# Altium schematic sheet LED.SchDoc
size A4; DocumentNumber: 1
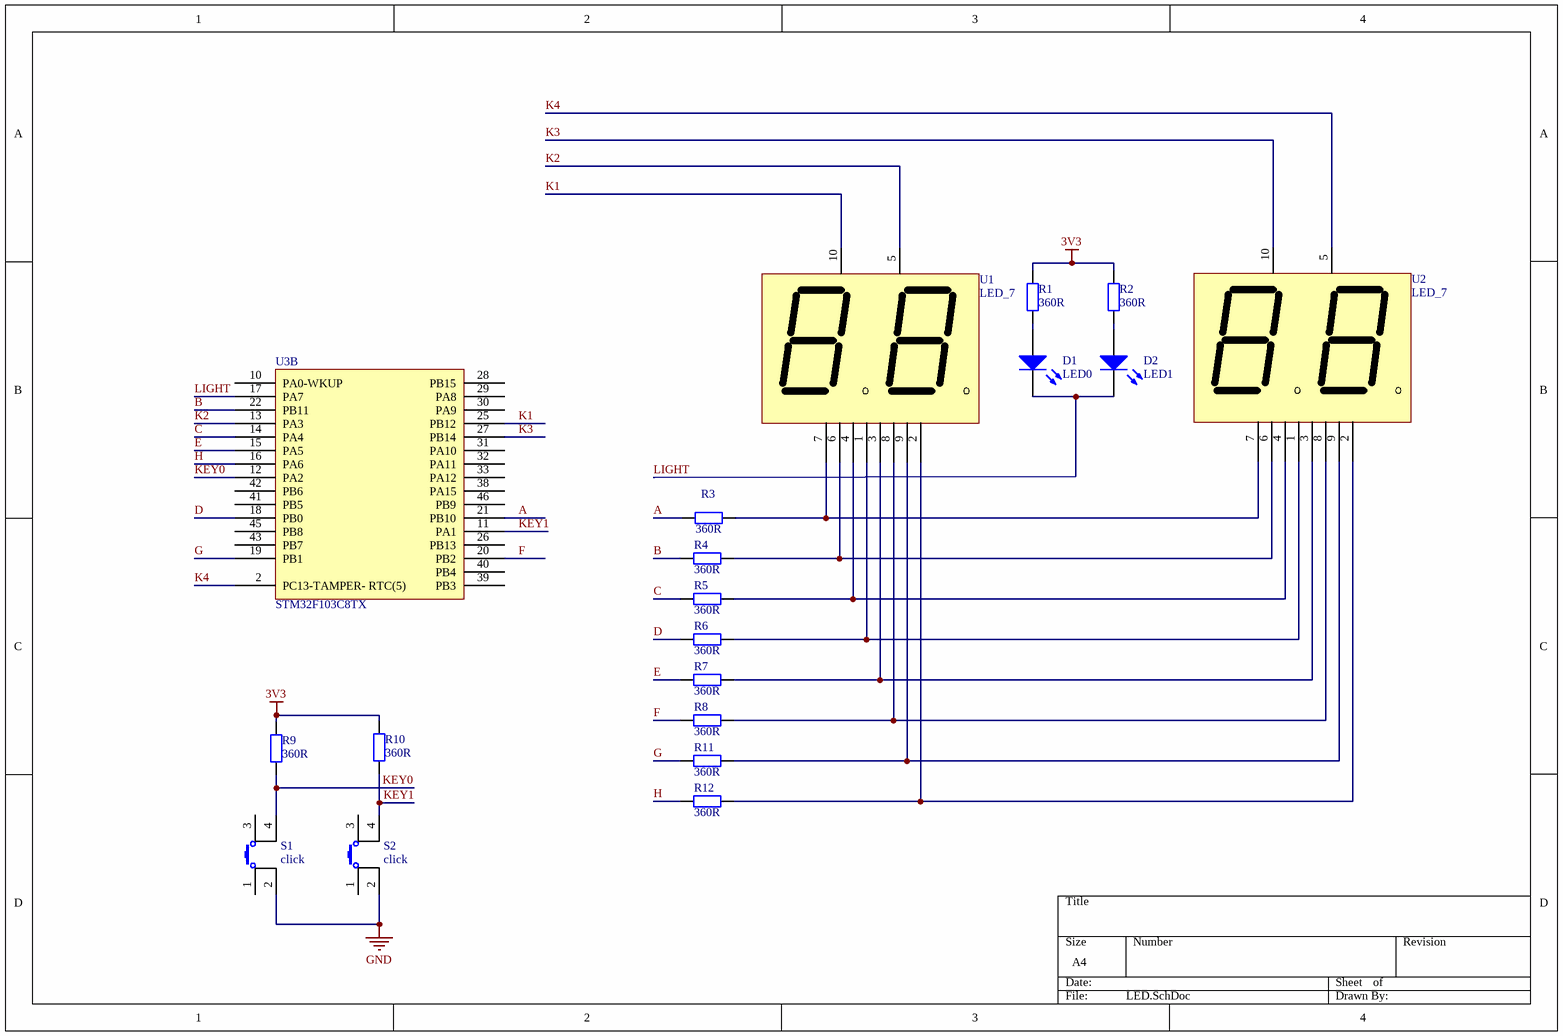
[diagram p0: LED.SchDoc]

## Parts
D1  LED0  [LED3MM-RED]
D2  LED1  [LED3MM-RED]
R1  360R  [R0603]
R2  360R  [R0603]
R3  360R  [R0603]
R4  360R  [R0603]
R5  360R  [R0603]
R6  360R  [R0603]
R7  360R  [R0603]
R8  360R  [R0603]
R9  360R  [R0603]
R10  360R  [R0603]
R11  360R  [R0603]
R12  360R  [R0603]
S1  click  [TSW SMD-6*6*5]
S2  click  [TSW SMD-6*6*5]
U1  LED_7  [SMG 0.56-2P]
U2  LED_7  [SMG 0.56-2P]
U3  STM32F103C8TX  [PQFP48]  (part B of 2)

## Nets
3V3: R1.2 R2.2 R9.2 R10.2
GND: S1.2 S2.2
A: R3.1 U3.21(PB10)
B: R4.1 U3.22(PB11)
C: R5.1 U3.14(PA4)
D: R6.1 U3.18(PB0)
E: R7.1 U3.15(PA5)
F: R8.1 U3.20(PB2)
G: R11.1 U3.19(PB1)
H: R12.1 U3.16(PA6)
K1: U1.10(COM) U3.25(PB12)
K2: U1.5(COM) U3.13(PA3)
K3: U2.10(COM) U3.27(PB14)
K4: U2.5(COM) U3.2(PC13-TAMPER-_RTC(5))
KEY0: R9.1 S1.4 U3.12(PA2)
KEY1: R10.1 S2.4 U3.11(PA1)
LIGHT: D1.2(K) D2.2(K) U3.17(PA7)
NetD1_1: D1.1(A) R1.1
NetD2_1: D2.1(A) R2.1
NetR3_2: R3.2 U1.7(A) U2.7(A)
NetR4_2: R4.2 U1.6(B) U2.6(B)
NetR5_2: R5.2 U1.4(C) U2.4(C)
NetR6_2: R6.2 U1.1(D) U2.1(D)
NetR7_2: R7.2 U1.3(E) U2.3(E)
NetR8_2: R8.2 U1.8(F) U2.8(F)
NetR11_2: R11.2 U1.9(G) U2.9(G)
NetR12_2: R12.2 U1.2(P) U2.2(P)

Not connected (* = marked no-connect by the designer): S1 1 3; S2 1 3; U3 10(PA0-WKUP) 26(PB13) 28(PB15) 29(PA8) 30(PA9) 31(PA10) 32(PA11) 33(PA12) 38(PA15) 39(PB3) 40(PB4) 41(PB5) 42(PB6) 43(PB7) 45(PB8) 46(PB9)

## Library data of the parts
D1 D2 = LED0: Typical INFRARED GaAs LED; Published: 8-Jun-2000; LatestRevisionDate: 08-Jul-2005; LatestRevisionNote: Mech Layer 1 removed.; PackageReference: LED-0; Publisher: Altium Limited; PackageDescription: LED; 2 Leads
R1-R12 = Res2: Resistor; Value: 1K; Published: 8-Jun-2000; LatestRevisionDate: 17-Jul-2002; LatestRevisionNote: Re-released for DXP Platform.; PackageReference: AXIAL-0.4; Publisher: Altium Limited; PackageDescription: Axial Device, Thru-Hole; 2 Leads; 0.4 in Pin Spacing
U3 = Component_1